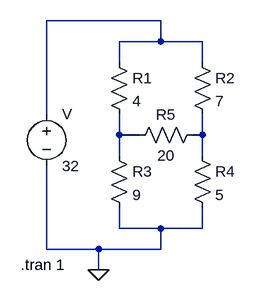
[diagram p0: schematic Bridge circuit.asc]
Bridge circuit.asc, the LTspice schematic file:
Version 4
SHEET 1 880 680
WIRE 256 48 80 48
WIRE 256 80 256 48
WIRE 256 80 192 80
WIRE 320 80 256 80
WIRE 192 112 192 80
WIRE 320 112 320 80
WIRE 80 192 80 48
WIRE 192 224 192 192
WIRE 224 224 192 224
WIRE 320 224 320 192
WIRE 320 224 304 224
WIRE 192 256 192 224
WIRE 320 256 320 224
WIRE 192 368 192 336
WIRE 256 368 192 368
WIRE 320 368 320 336
WIRE 320 368 256 368
WIRE 80 400 80 272
WIRE 160 400 80 400
WIRE 256 400 256 368
WIRE 256 400 160 400
WIRE 160 432 160 400
FLAG 160 432 0
SYMBOL res 176 96 R0
SYMATTR InstName R1
SYMATTR Value 4
SYMBOL res 304 96 R0
SYMATTR InstName R2
SYMATTR Value 7
SYMBOL res 176 240 R0
SYMATTR InstName R3
SYMATTR Value 9
SYMBOL res 304 240 R0
SYMATTR InstName R4
SYMATTR Value 5
SYMBOL res 320 208 R90
WINDOW 0 0 56 VBottom 2
WINDOW 3 32 56 VTop 2
SYMATTR InstName R5
SYMATTR Value 20
SYMBOL voltage 80 176 R0
WINDOW 123 0 0 Left 0
WINDOW 39 0 0 Left 0
SYMATTR InstName V
SYMATTR Value 32
TEXT 40 424 Left 2 !.tran 1

The netlist it stands for:
* Bridge circuit.asc
R1 N001 N002 4
R2 N001 N003 7
R3 N002 0 9
R4 N003 0 5
R5 N003 N002 20
V N001 0 32
.tran 1
.backanno
.end